# Altium project ESC_STM32.PrjPcb
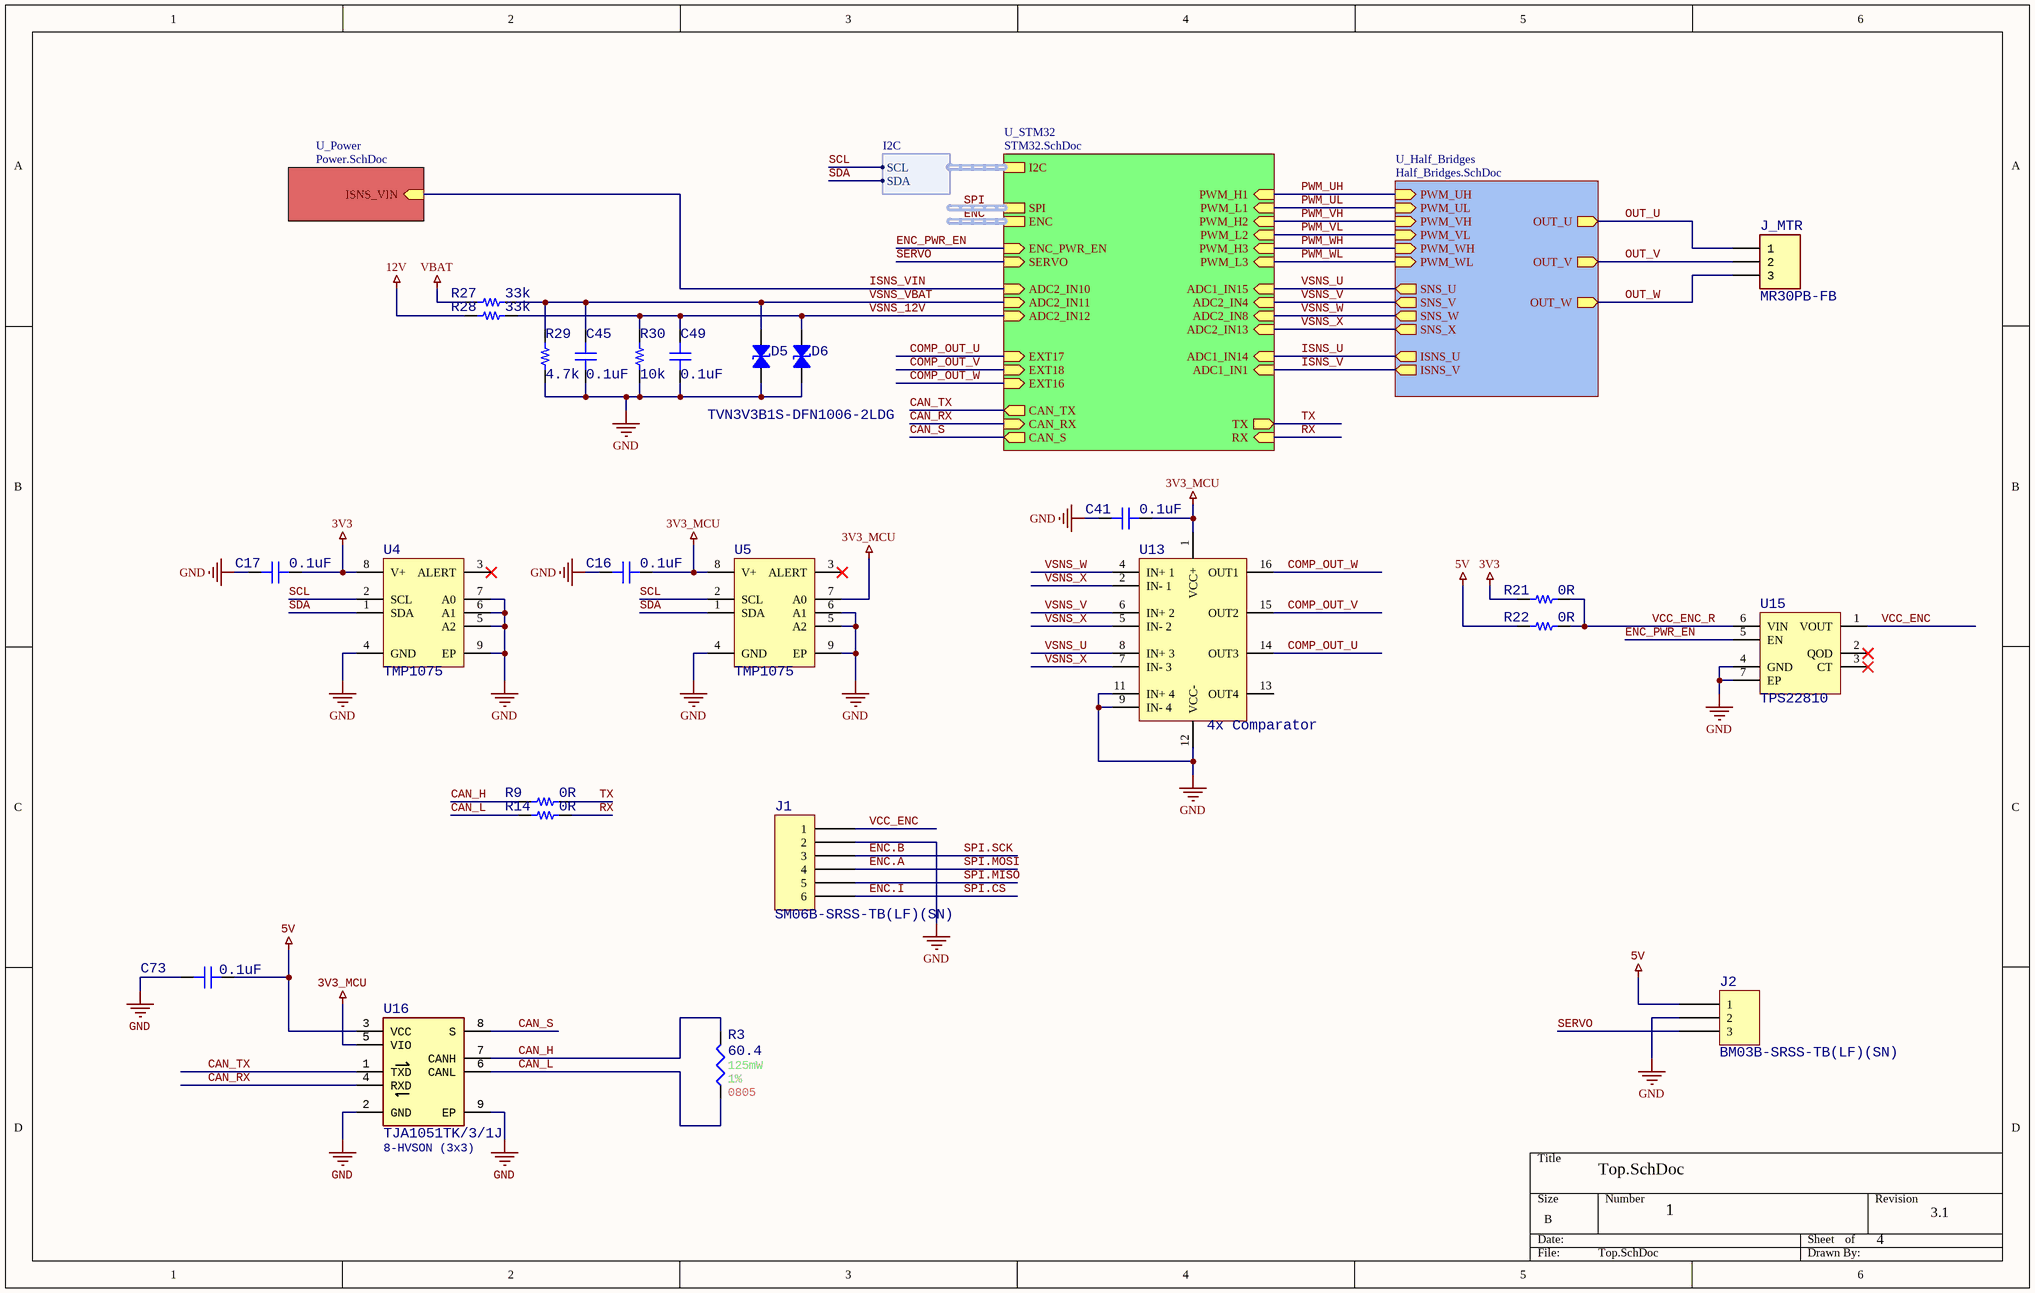
[diagram p0: Top.SchDoc]
Project: Cubli; ProjectRevision: 3.1
4 sheets, 153 parts. Net scope: hierarchical (ports join the sheet entries above them; power ports are global).
Board file: ESC_STM32.PcbDoc
Sheets:
  Top.SchDoc
    U_STM32 = STM32.SchDoc
    U_Power = Power.SchDoc
    U_Half_Bridges = Half_Bridges.SchDoc

## Sheet Top.SchDoc
size B; DocumentNumber: 5; Revision: 1.1; SheetNumber: 1; SheetTotal: 4

### Parts
C16  0.1uF  [CAP_0402]
C17  0.1uF  [CAP_0402]
C41  0.1uF  [CAP_0402]
C45  0.1uF  [CAP_0402]
C49  0.1uF  [CAP_0402]
C73  0.1uF  [CAP_0402]
D5  TVN3V3B1S-DFN1006-2LDG  [0402]
D6  TVN3V3B1S-DFN1006-2LDG  [0402]  (value not drawn)
J1  SM06B-SRSS-TB(LF)(SN)  [JST SM06B-SRSS-TB]
J2  BM03B-SRSS-TB(LF)(SN)  [JST BM03B-SRSS-TB]
J_MTR  MR30PB-FB  [MR30PB-F]
R3  value 60.4  Power: 125mW  Tolerance: 1%  Case/Package: 0805  [0805 Resistor]  (hidden comment: TFA0805R60R4F-T5)
R9  0R  [RES_0402]
R14  0R  [RES_0402]
R21  0R  [RES_0402]
R22  0R  [RES_0402]
R27  33k  [RES_0402]
R28  33k  [RES_0402]
R29  4.7k  [RES_0402]
R30  10k  [RES_0402]
U4  TMP1075  [8_WSON_2x2_0.5mm]
U5  TMP1075  [8_WSON_2x2_0.5mm]
U13  4x Comparator  [QFN50P300X300X100-16N]
U15  TPS22810  [6-WSON_2x2_0.65mm]
U16  TJA1051TK/3/1J  Case/Package: 8-HVSON (3x3)  [TJA1044xxK]

### Sub-sheets
U_Half_Bridges = Half_Bridges.SchDoc: PWM_UH (in), PWM_UL (in), PWM_VH (in), PWM_VL (in), PWM_WH (in), PWM_WL (in), SNS_U (out), SNS_V (out), SNS_W (out), SNS_X (out), OUT_U (out), OUT_V (out), OUT_W (out), ISNS_U (out), ISNS_V (out)
U_Power = Power.SchDoc: ISNS_VIN (in)
U_STM32 = STM32.SchDoc: I2C (harness I2C), PWM_L1 (in), PWM_H1 (in), PWM_L2 (in), PWM_H2 (in), PWM_L3 (in), PWM_H3 (in), ENC (harness ENC), ADC1_IN1 (in), ADC1_IN14 (in), EXT16 (in), EXT17 (in), EXT18 (in), ADC2_IN10 (in), SPI (harness SPI), ENC_PWR_EN (in), ADC2_IN11 (in), ADC2_IN12 (in), ADC2_IN4 (in), ADC2_IN8 (in), ADC2_IN13 (in), ADC1_IN15 (in), SERVO (in), CAN_TX (out), CAN_RX (in), CAN_S (out), TX (out), RX (in)

### Harnesses
I2C: SCL, SDA

### Nets
3V3: C17.2 R21.2 U4.8(V+)
3V3_MCU: C16.2 C41.2 U5.7(A0) U5.8(V+) U13.1(VCC+) U16.5(VIO)
5V: C73.1 J2.1 R22.2 U16.3(VCC)
12V: R28.2
GND: C16.1 C17.1 C41.1 C45.1 C49.1 C73.2 D5.1 D6.1 J1.2 J2.2 R29.2 R30.2 U4.4(GND) U4.5(A2) U4.6(A1) U4.7(A0) U4.9(EP) U5.4(GND) U5.5(A2) U5.6(A1) U5.9(EP) U13.9(IN-_4) U13.11(IN+_4) U13.12(VCC-) U15.4(GND) U15.7(EP) U16.2(GND) U16.9(EP)
VBAT: R27.2
CAN_H: R3.2 R9.2 U16.7(CANH)
CAN_L: R3.1 R14.2 U16.6(CANL)
CAN_RX: U16.4(RXD) ; sheet U_STM32/CAN_RX
CAN_S: U16.8(S) ; sheet U_STM32/CAN_S
CAN_TX: U16.1(TXD) ; sheet U_STM32/CAN_TX
COMP_OUT_U: U13.14(OUT3) ; sheet U_STM32/EXT17
COMP_OUT_V: U13.15(OUT2) ; sheet U_STM32/EXT18
COMP_OUT_W: U13.16(OUT1) ; sheet U_STM32/EXT16
ENC.A: J1.4  [also labelled SPI.MOSI]
ENC.B: J1.3  [also labelled SPI.SCK]
ENC.I: J1.6  [also labelled SPI.~{CS}]
ENC_PWR_EN: U15.5(EN) ; sheet U_STM32/ENC_PWR_EN
ISNS_U: sheet U_STM32/ADC1_IN14, sheet U_Half_Bridges/ISNS_U
ISNS_V: sheet U_STM32/ADC1_IN1, sheet U_Half_Bridges/ISNS_V
ISNS_VIN: sheet U_STM32/ADC2_IN10, sheet U_Power/ISNS_VIN
OUT_U: J_MTR.1 ; sheet U_Half_Bridges/OUT_U
OUT_V: J_MTR.2 ; sheet U_Half_Bridges/OUT_V
OUT_W: J_MTR.3 ; sheet U_Half_Bridges/OUT_W
PWM_UH: sheet U_STM32/PWM_H1, sheet U_Half_Bridges/PWM_UH
PWM_UL: sheet U_STM32/PWM_L1, sheet U_Half_Bridges/PWM_UL
PWM_VH: sheet U_STM32/PWM_H2, sheet U_Half_Bridges/PWM_VH
PWM_VL: sheet U_STM32/PWM_L2, sheet U_Half_Bridges/PWM_VL
PWM_WH: sheet U_STM32/PWM_H3, sheet U_Half_Bridges/PWM_WH
PWM_WL: sheet U_STM32/PWM_L3, sheet U_Half_Bridges/PWM_WL
RX: R14.1 ; sheet U_STM32/RX
SCL: U4.2(SCL) U5.2(SCL) ; sheet U_STM32/I2C.SCL
SDA: U4.1(SDA) U5.1(SDA) ; sheet U_STM32/I2C.SDA
SERVO: J2.3 ; sheet U_STM32/SERVO
SPI.MISO: J1.5
TX: R9.1 ; sheet U_STM32/TX
VCC_ENC: J1.1 U15.1(VOUT)
VCC_ENC_R: R21.1 R22.1 U15.6(VIN)
VSNS_12V: C49.2 D6.2 R28.1 R30.1 ; sheet U_STM32/ADC2_IN12
VSNS_U: U13.8(IN+_3) ; sheet U_STM32/ADC1_IN15, sheet U_Half_Bridges/SNS_U
VSNS_V: U13.6(IN+_2) ; sheet U_STM32/ADC2_IN4, sheet U_Half_Bridges/SNS_V
VSNS_VBAT: C45.2 D5.2 R27.1 R29.1 ; sheet U_STM32/ADC2_IN11
VSNS_W: U13.4(IN+_1) ; sheet U_STM32/ADC2_IN8, sheet U_Half_Bridges/SNS_W
VSNS_X: U13.2(IN-_1) U13.5(IN-_2) U13.7(IN-_3) ; sheet U_STM32/ADC2_IN13, sheet U_Half_Bridges/SNS_X

Not connected (* = marked no-connect by the designer): U4 3(ALERT)*; U5 3(ALERT)*; U13 13(OUT4); U15 2(QOD)* 3(CT)*

### Buses and harness runs
harness ENC = sheet U_STM32/ENC
harness SPI = sheet U_STM32/SPI

### Library data of the parts
C16 C17 C41 C45 C49 C73 = CAP_0402: CAP CER 402; Value: 0.1uF
D5 D6 = TVN3V3B1S-DFN1006-2LDG: TVS DIODE 3.3V 14.2PF DFN1006; Manufacturer: INPAQ Technology Co., Ltd; Bidirectional Channels: 1; Capacitance @ Frequency: 11.5pF @ 1MHz; Current - Peak Pulse (10/1000µs): 8A (8/20µs); Power Line Protection: No; Type: Zener; Voltage - Breakdown (Min): 4V; Voltage - Clamping (Max) @ Ipp: 6.6V (Typ); Voltage - Reverse Standoff (Typ): 3.3V (Max); Part Number: TVN3V3B1S-DFN1006-2LDG; Applications: General Purpose; ComponentLink1Description: Datasheet; ComponentLink1URL: https://mm.digikey.com/Volume0/opasdata/d220001/medias/docus/5383/TVN3V3B1S-DFN1006-2LDG.pdf; ComponentLink2Description: DigiKey Link; ComponentLink2URL: https://www.digikey.com/en/products/detail/inpaq-technology-co-ltd/TVN3V3B1S-DFN1006-2LDG/20486686; Device Package: 0402 (1005 Metric); LastUpdated: 6/3/2024 8:22:57 PM; Lifecycle Status: Active; Minimum Order: 1; Mounting Type: Surface Mount; Operating Temperature: 150°C (TJ); Package / Case: 0402 (1005 Metric); Packaging: TapeAndReel; PartId: 11821; Price: 0.02; Series: TVN; Supplier 1: DigiKey; Supplier Part Number 1: 3526-TVN3V3B1S-DFN1006-2LDGCT-ND; Supplier Device Package: DFN1006
J1 = SM06B-SRSS-TB(LF)(SN): CONN HEADER SMD R/A 6POS 1MM; Manufacturer: JST Sales America Inc.; Current Rating (Amps): 0.7A; Material Flammability Rating: UL94 V-0; Number of Positions: 6; Number of Positions Loaded: All; Pitch - Mating: 0.039" (1.00mm); Shrouding: Shrouded - 4 Wall; Style: Board to Cable/Wire; Voltage Rating: 50V; Part Number: SM06B-SRSS-TB(LF)(SN); ComponentLink1Description: Datasheet; ComponentLink1URL: http://www.jst-mfg.com/product/pdf/eng/eSH.pdf; ComponentLink2Description: DigiKey Link; ComponentLink2URL: http://digikey.com/product-detail/en/jst-sales-america-inc/SM06B-SRSS-TB-LF-SN/455-1806-1-ND/926877; Connector Type: Header; Contact Finish - Mating: Tin; Contact Finish - Post: Tin; Contact Material: Copper Alloy; Contact Shape: Square; Contact Type: Male Pin; Fastening Type: Push-Pull; Features: Solder Retention; Insulation Color: Natural; Insulation Height: 0.114" (2.90mm); Insulation Material: Polyamide (PA), Nylon; LastUpdated: 1/12/2020 11:42:14 PM; Lifecycle Status: Active; Minimum Order: 1; Mounting Type: Surface Mount, Right Angle; Number of Rows: 1; Operating Temperature: -25°C ~ 85°C; Packaging: TapeAndReel; PartId: 64; Part Status: Active; Price: 0.36; Series: SR; Supplier 1: DigiKey; Supplier Part Number 1: 455-1806-1-ND; Termination: Solder
J2 = BM03B-SRSS-TB(LF)(SN): CONN HEADER SMD 3POS 1MM; Manufacturer: JST Sales America Inc.; Current Rating (Amps): 0.7A; Material Flammability Rating: UL94 V-0; Number of Positions: 3; Number of Positions Loaded: All; Pitch - Mating: 0.039" (1.00mm); Shrouding: Shrouded - 4 Wall; Style: Board to Cable/Wire; Voltage Rating: 50V; Part Number: BM03B-SRSS-TB(LF)(SN); ComponentLink1Description: Datasheet; ComponentLink1URL: http://www.jst-mfg.com/product/pdf/eng/eSR.pdf; ComponentLink2Description: DigiKey Link; ComponentLink2URL: http://digikey.com/product-detail/en/jst-sales-america-inc/BM03B-SRSS-TB-LF-SN/455-1789-1-ND/926860; Connector Type: Header; Contact Finish - Mating: Tin; Contact Finish - Post: Tin; Contact Material: Copper Alloy; Contact Shape: Square; Contact Type: Male Pin; Fastening Type: Push-Pull; Features: Solder Retention; Insulation Color: Natural; Insulation Height: 0.167" (4.25mm); Insulation Material: Polyamide (PA), Nylon; LastUpdated: 1/12/2020 10:12:14 PM; Lifecycle Status: Active; Minimum Order: 1; Mounting Type: Surface Mount; Number of Rows: 1; Operating Temperature: -25°C ~ 85°C; Packaging: TapeAndReel; PartId: 14; Part Status: Active; Price: 0.24; Series: SR; Supplier 1: DigiKey; Supplier Part Number 1: 455-1789-1-ND; Termination: Solder
J_MTR = CMP-002-00125-1: Vertical 3 pin barrel connector; Manufacturer: Amass; Gender: Female; Max Current Rating: 30A; Pins: 3
R3 = CMP-009-00189-2: Res 60.4 Ohm 1% 1/8W 0805; AECQ: Yes; Manufacturer Part Number: TFA0805R60R4F-T5; Mounting Technology: SMD; Pins: 2
R9 R14 R21 R22 R27-R30 = RES_0402: RES 0402
U4 U5 = TMP1075: I2C TEMP SENSOR
U13 = LM2901Q4T: Comparator General Purpose CMOS, DTL, MOS, Open-Collector, TTL 16-QFN (3x3)
U15 = TPS22810DRVR: Load switch TPS22810DRVR
U16 = CMP-031-00007-3: Interface Circuit, PDSO8; AECQ: Yes; Max Operating Temperature: 150°C; Pins: 8; Min Operating Temperature: -40°C

## Sheet STM32.SchDoc
size B; DocumentNumber: 3; SheetNumber: 2; SheetTotal: 4
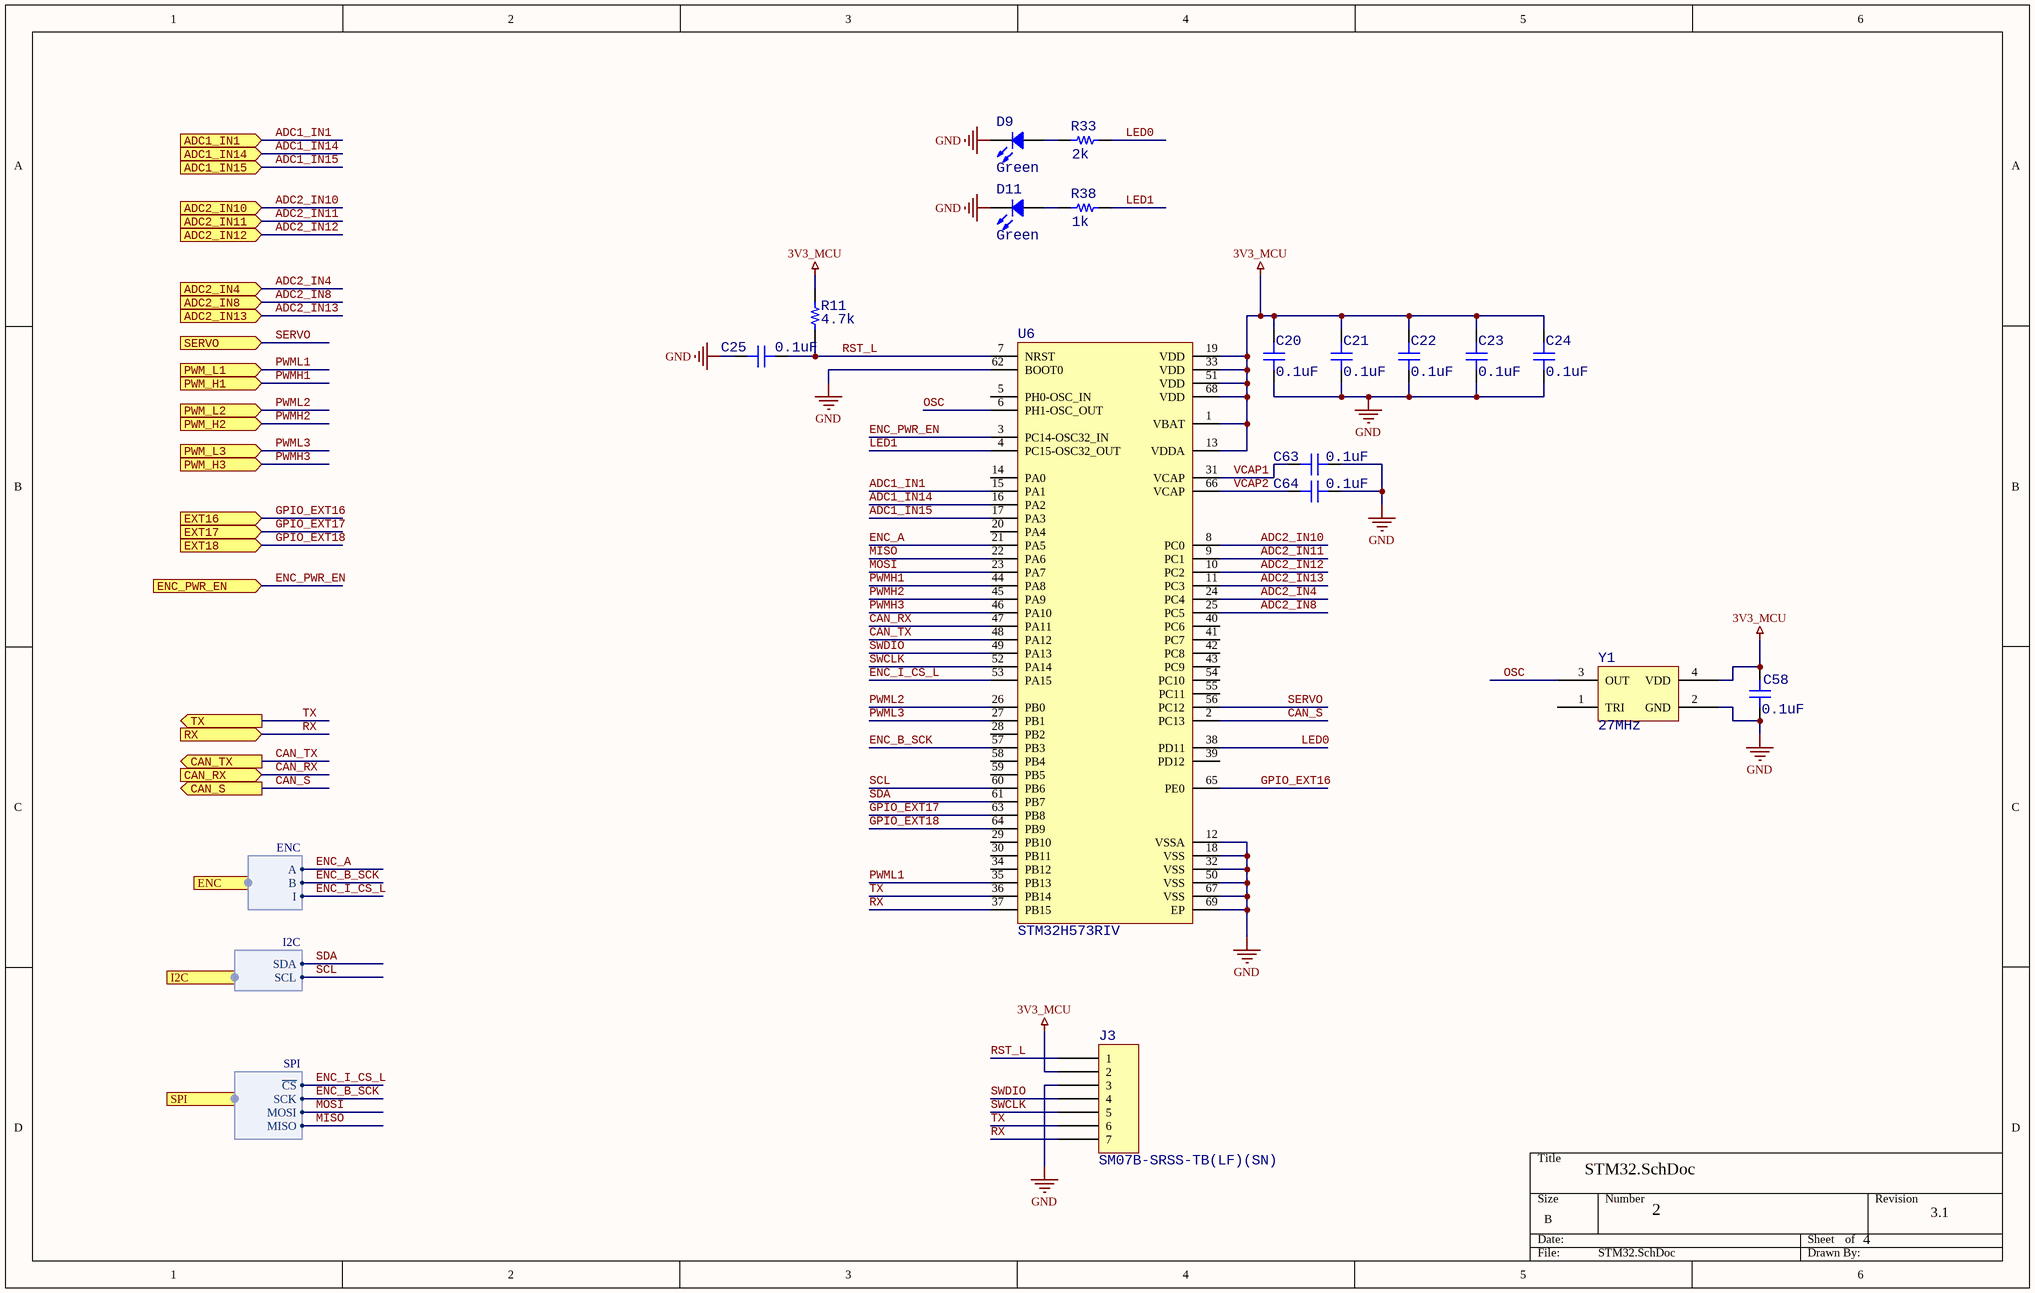
[diagram p1: STM32.SchDoc]

### Parts
C20  0.1uF  [CAP_0402]
C21  0.1uF  [CAP_0402]
C22  0.1uF  [CAP_0402]
C23  0.1uF  [CAP_0402]
C24  0.1uF  [CAP_0402]
C25  0.1uF  [CAP_0402]
C58  0.1uF  [CAP_0402]
C63  0.1uF  [CAP_0402]
C64  0.1uF  [CAP_0402]
D9  Green  [LED 0603_1608 GREEN]
D11  Green  [LED 0603_1608 GREEN]
J3  SM07B-SRSS-TB(LF)(SN)  [JST SM07B-SRSS-TB]
R11  4.7k  [RES_0402]
R33  2k  [RES_0402]
R38  1k  [RES_0402]
U6  STM32H573RIV  [68-VFQFPN]
Y1  27MHz  [ABRACON ASD]

### Ports
ADC1_IN1 (in), ADC1_IN14 (in), ADC1_IN15 (in), ADC2_IN4 (in), ADC2_IN8 (in), ADC2_IN10 (in), ADC2_IN11 (in), ADC2_IN12 (in), ADC2_IN13 (in), CAN_RX (in), CAN_S (out), CAN_TX (out), ENC (harness ENC), ENC_PWR_EN (in), EXT16 (in), EXT17 (in), EXT18 (in), I2C (harness I2C), PWM_H1 (in), PWM_H2 (in), PWM_H3 (in), PWM_L1 (in), PWM_L2 (in), PWM_L3 (in), RX (in), SERVO (in), SPI (harness SPI), TX (out)

### Harnesses
I2C: SDA, SCL
ENC: A, B, I
SPI: ~{CS}, SCK, MOSI, MISO

### Nets
3V3_MCU: C20.2 C21.2 C22.2 C23.2 C24.2 C58.2 J3.2 R11.2 U6.1(VBAT) U6.13(VDDA) U6.19(VDD) U6.33(VDD) U6.51(VDD) U6.68(VDD) Y1.4(VDD)
GND: C20.1 C21.1 C22.1 C23.1 C24.1 C25.2 C58.1 C63.1 C64.1 D9.2 D11.2 J3.3 U6.12(VSSA) U6.18(VSS) U6.32(VSS) U6.50(VSS) U6.62(BOOT0) U6.67(VSS) U6.69(EP) Y1.2(GND)
ADC1_IN1: U6.15(PA1) ; port ADC1_IN1  [project net ISNS_V]
ADC1_IN14: U6.16(PA2) ; port ADC1_IN14  [project net ISNS_U]
ADC1_IN15: U6.17(PA3) ; port ADC1_IN15  [project net VSNS_U]
ADC2_IN4: U6.24(PC4) ; port ADC2_IN4  [project net VSNS_V]
ADC2_IN8: U6.25(PC5) ; port ADC2_IN8  [project net VSNS_W]
ADC2_IN10: U6.8(PC0) ; port ADC2_IN10  [project net ISNS_VIN]
ADC2_IN11: U6.9(PC1) ; port ADC2_IN11  [project net VSNS_VBAT]
ADC2_IN12: U6.10(PC2) ; port ADC2_IN12  [project net VSNS_12V]
ADC2_IN13: U6.11(PC3) ; port ADC2_IN13  [project net VSNS_X]
CAN_RX: U6.47(PA11) ; port CAN_RX
CAN_S: U6.2(PC13) ; port CAN_S
CAN_TX: U6.48(PA12) ; port CAN_TX
ENC_A: U6.21(PA5) ; port ENC.A  [project net ENC.A]
ENC_B_SCK: U6.57(PB3) ; port ENC.B, port SPI.SCK  [project net ENC.B]
ENC_I_CS_L: U6.53(PA15) ; port ENC.I, port SPI.~{CS}  [project net ENC.I]
ENC_PWR_EN: U6.3(PC14-OSC32_IN) ; port ENC_PWR_EN
GPIO_EXT16: U6.65(PE0) ; port EXT16  [project net COMP_OUT_W]
GPIO_EXT17: U6.63(PB8) ; port EXT17  [project net COMP_OUT_U]
GPIO_EXT18: U6.64(PB9) ; port EXT18  [project net COMP_OUT_V]
LED0: R33.2 U6.38(PD11)
LED1: R38.2 U6.4(PC15-OSC32_OUT)
MISO: U6.22(PA6) ; port SPI.MISO  [project net SPI.MISO]
MOSI: U6.23(PA7) ; port SPI.MOSI  [project net SPI.MOSI]
OSC: U6.6(PH1-OSC_OUT) Y1.3(OUT)
PWMH1: U6.44(PA8) ; port PWM_H1  [project net PWM_UH]
PWMH2: U6.45(PA9) ; port PWM_H2  [project net PWM_VH]
PWMH3: U6.46(PA10) ; port PWM_H3  [project net PWM_WH]
PWML1: U6.35(PB13) ; port PWM_L1  [project net PWM_UL]
PWML2: U6.26(PB0) ; port PWM_L2  [project net PWM_VL]
PWML3: U6.27(PB1) ; port PWM_L3  [project net PWM_WL]
RST_L: C25.1 J3.1 R11.1 U6.7(NRST)
RX: J3.7 U6.37(PB15) ; port RX
SCL: U6.60(PB6) ; port I2C.SCL
SDA: U6.61(PB7) ; port I2C.SDA
SERVO: U6.56(PC12) ; port SERVO
SWCLK: J3.5 U6.52(PA14)
SWDIO: J3.4 U6.49(PA13)
TX: J3.6 U6.36(PB14) ; port TX
VCAP1: C63.2 U6.31(VCAP)
VCAP2: C64.2 U6.66(VCAP)
NetD9_1: D9.1 R33.1
NetD11_1: D11.1 R38.1

Not connected (* = marked no-connect by the designer): U6 5(PH0-OSC_IN) 14(PA0) 20(PA4) 28(PB2) 29(PB10) 30(PB11) 34(PB12) 39(PD12) 40(PC6) 41(PC7) 42(PC8) 43(PC9) 54(PC10) 55(PC11) 58(PB4) 59(PB5); Y1 1(TRI)

### Library data of the parts
C20-C25 C58 C63 C64 = CAP_0402: CAP CER 402; Value: 0.1uF
D9 D11 = XZCDGK53W-8VF: LED GREEN CLEAR 2SMD; Manufacturer: SunLED; Configuration: Independent; Current - Test: 2mA; Lens Color: Colorless; Lens Size: 0.35mm Dia; Lens Style: Round with Domed Top; Millicandela Rating: 417mcd; Viewing Angle: 60°; Voltage - Forward (Vf) (Typ): 2.65V; Wavelength - Dominant: 525nm; Wavelength - Peak: 515nm; Part Number: XZCDGK53W-8VF; Color: Green; ComponentLink1Description: Datasheet; ComponentLink1URL: https://www.sunledusa.com/products/spec/XZCDGK53W-8VF.pdf; ComponentLink2Description: DigiKey Link; ComponentLink2URL: https://www.digikey.com/en/products/detail/sunled/XZCDGK53W-8VF/10449775; Device Package: 0603 (1608 Metric); Height (Max): 1.10mm; LastUpdated: 6/3/2024 7:58:52 PM; Lens Transparency: Clear; Lifecycle Status: Active; Minimum Order: 1; Mounting Type: Surface Mount; Package / Case: 0603 (1608 Metric); Packaging: TapeAndReel; PartId: 938; Part Status: Active; Price: 0.15; Series: Ultra Low Current; Size / Dimension: 1.60mm L x 0.80mm W; Supplier 1: DigiKey; Supplier Part Number 1: 1497-XZCDGK53W-8VFCT-ND; Supplier Device Package: 2-SMD; Value: Green
J3 = SM07B-SRSS-TB(LF)(SN): CONN HEADER SMD R/A 7POS 1MM; Manufacturer: JST Sales America Inc.; Current Rating (Amps): 0.7A; Material Flammability Rating: UL94 V-0; Number of Positions: 7; Number of Positions Loaded: All; Pitch - Mating: 0.039" (1.00mm); Shrouding: Shrouded - 4 Wall; Style: Board to Cable/Wire; Voltage Rating: 50V; Part Number: SM07B-SRSS-TB(LF)(SN); ComponentLink1Description: Datasheet; ComponentLink1URL: http://www.jst-mfg.com/product/pdf/eng/eSH.pdf; ComponentLink2Description: DigiKey Link; ComponentLink2URL: http://digikey.com/product-detail/en/jst-sales-america-inc/SM07B-SRSS-TB-LF-SN/455-1807-1-ND/926878; Connector Type: Header; Contact Finish - Mating: Tin; Contact Finish - Post: Tin; Contact Material: Copper Alloy; Contact Shape: Square; Contact Type: Male Pin; Fastening Type: Push-Pull; Features: Solder Retention; Insulation Color: Natural; Insulation Height: 0.114" (2.90mm); Insulation Material: Polyamide (PA), Nylon; LastUpdated: 1/12/2020 11:42:26 PM; Lifecycle Status: Active; Minimum Order: 1; Mounting Type: Surface Mount, Right Angle; Number of Rows: 1; Operating Temperature: -25°C ~ 85°C; Packaging: TapeAndReel; PartId: 65; Part Status: Active; Price: 0.39; Series: SR; Supplier 1: DigiKey; Supplier Part Number 1: 455-1807-1-ND; Termination: Solder
R11 R33 R38 = RES_0402: RES 0402
Y1 = ASD3-27.000MHZ-EC-T: XTAL OSC XO 27.0000MHZ HCMOS SMD; Manufacturer: Abracon LLC; Base Resonator: Crystal; Current - Supply (Max): 4mA; Frequency Stability: ±50ppm; Function: Enable/Disable; Voltage - Supply: 1.8V; Part Number: ASD3-27.000MHZ-EC-T; ComponentLink1Description: Datasheet; ComponentLink1URL: https://abracon.com/Oscillators/ASDseries.pdf; ComponentLink2Description: DigiKey Link; ComponentLink2URL: http://digikey.com/product-detail/en/abracon-llc/ASD3-27.000MHZ-EC-T/535-9608-1-ND/1237075; Frequency: 27MHz; Height - Seated (Max): 0.039" (1.00mm); LastUpdated: 6/3/2024 8:02:05 PM; Lifecycle Status: Active; Minimum Order: 1; Mounting Type: Surface Mount; Operating Temperature: -20°C ~ 70°C; Output: HCMOS; Package / Case: 4-SMD, No Lead; Packaging: TapeAndReel; PartId: 4; Part Status: Active; Price: 1.74; Series: ASD; Size / Dimension: 0.098" L x 0.079" W (2.50mm x 2.00mm); Supplier 1: DigiKey; Supplier Part Number 1: 535-9608-1-ND; Type: XO (Standard); Value: 27MHz

## Sheet Power.SchDoc
size B; DocumentNumber: 4; SheetNumber: 3; SheetTotal: 4
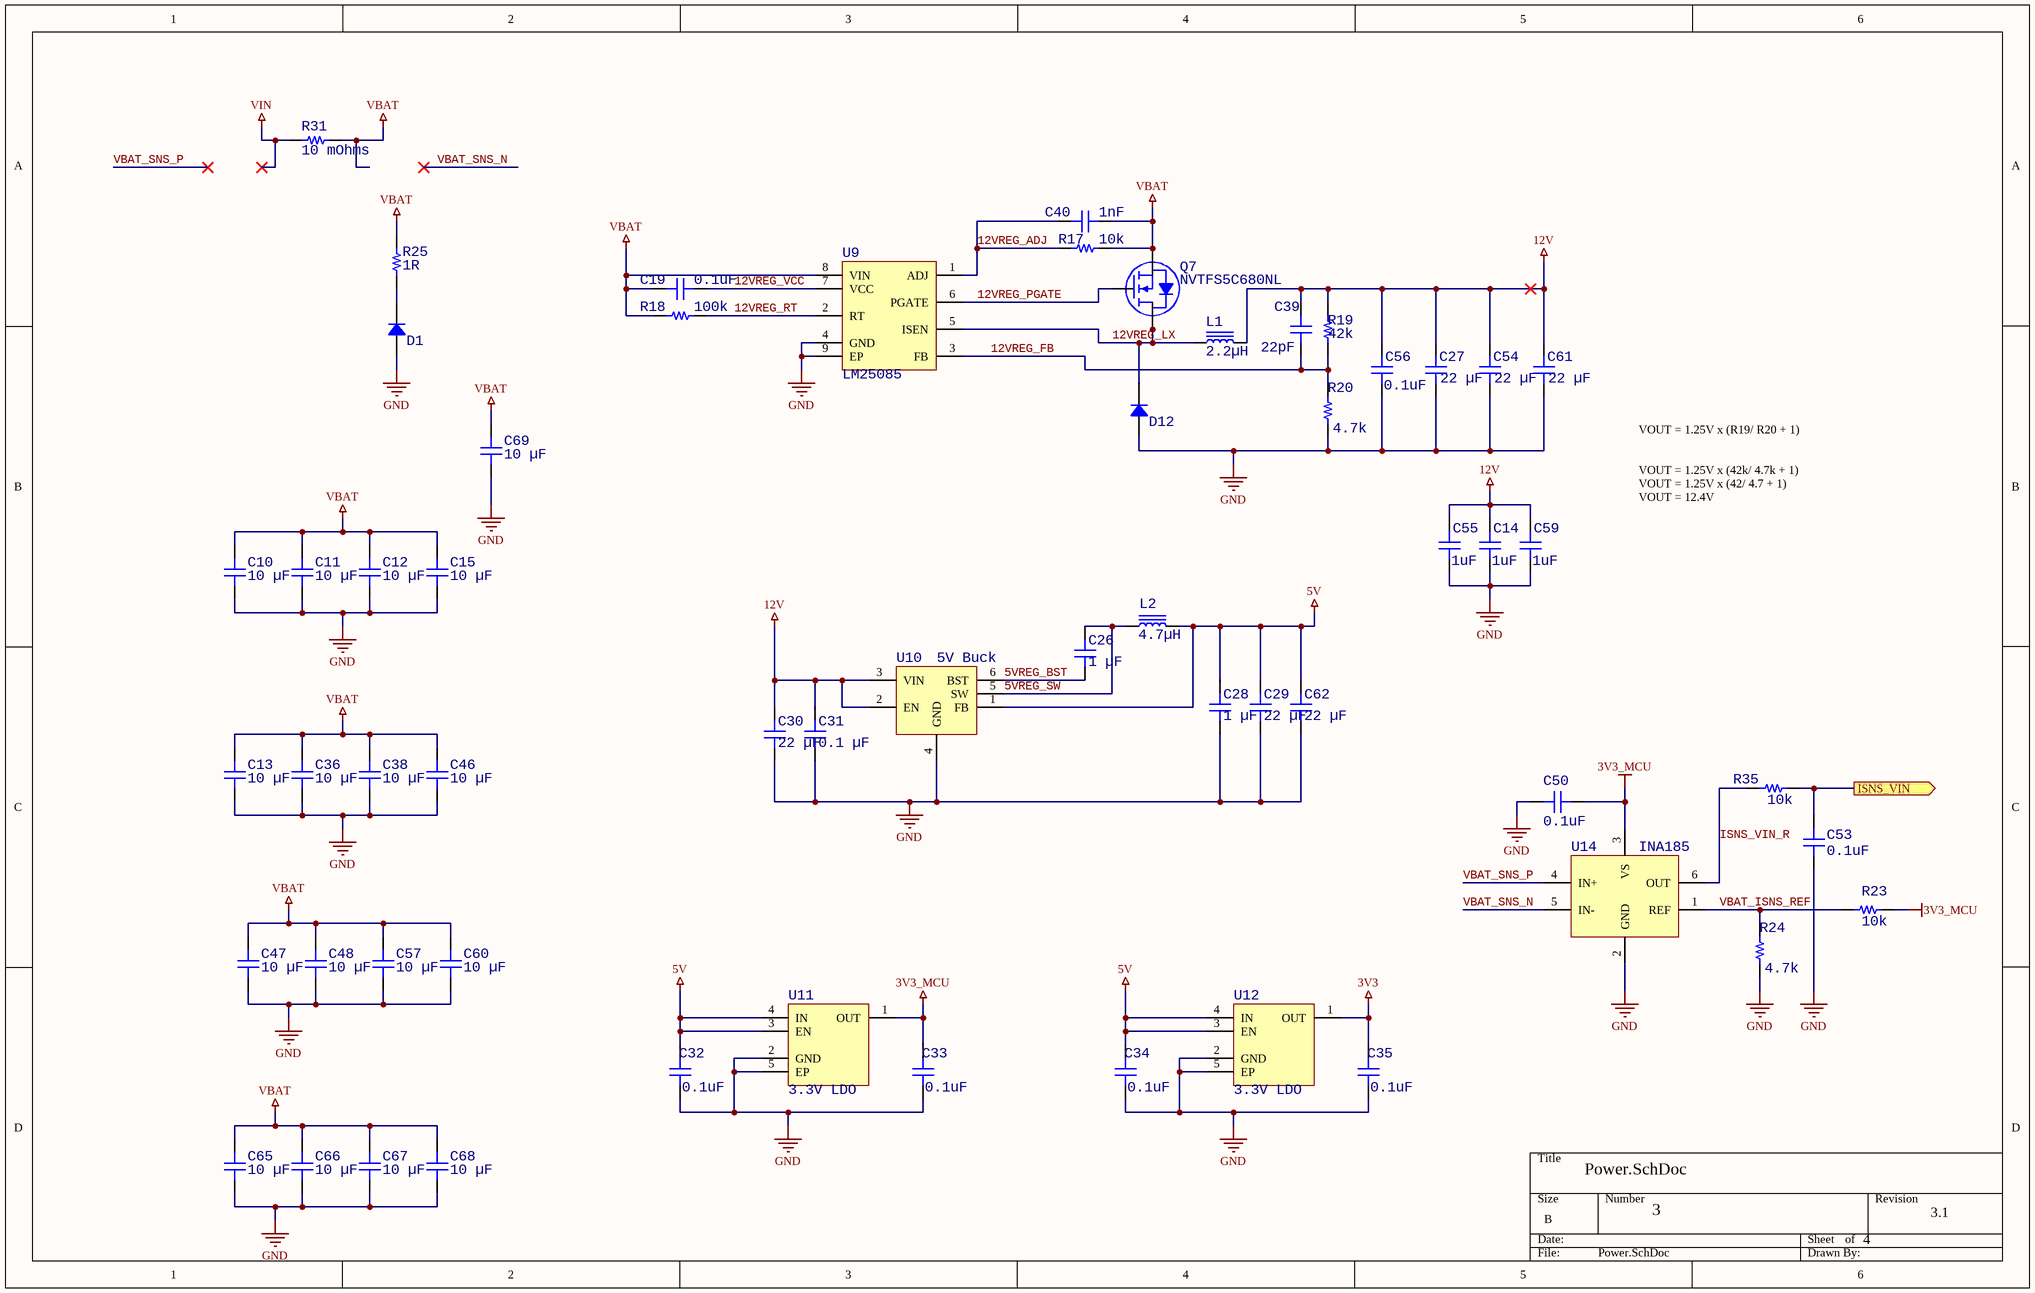
[diagram p2: Power.SchDoc]

### Parts
C10  10 µF  [CAP 1206_3216 - 0.8MM]
C11  10 µF  [CAP 1206_3216 - 0.8MM]
C12  10 µF  [CAP 1206_3216 - 0.8MM]
C13  10 µF  [CAP 1206_3216 - 0.8MM]
C14  1uF  [CAP_0402]
C15  10 µF  [CAP 1206_3216 - 0.8MM]
C19  0.1uF  [CAP_0402]
C26  1 µF  [CAP 0402_1005]
C27  22 µF  [CAP 0805_2012]
C28  1 µF  [CAP 0402_1005]
C29  22 µF  [CAP 0603_1608]
C30  22 µF  [CAP 0603_1608]
C31  0.1 µF  [CAP 0402_1005]
C32  0.1uF  [CAP_0402]
C33  0.1uF  [CAP_0402]
C34  0.1uF  [CAP_0402]
C35  0.1uF  [CAP_0402]
C36  10 µF  [CAP 1206_3216 - 0.8MM]
C38  10 µF  [CAP 1206_3216 - 0.8MM]
C39  22pF  [CAP_0402]
C40  1nF  [CAP_0402]
C46  10 µF  [CAP 1206_3216 - 0.8MM]
C47  10 µF  [CAP 1206_3216 - 0.8MM]
C48  10 µF  [CAP 1206_3216 - 0.8MM]
C50  0.1uF  [CAP_0402]
C53  0.1uF  [CAP_0402]
C54  22 µF  [CAP 0805_2012]
C55  1uF  [CAP_0402]
C56  0.1uF  [CAP_0402]
C57  10 µF  [CAP 1206_3216 - 0.8MM]
C59  1uF  [CAP_0402]
C60  10 µF  [CAP 1206_3216 - 0.8MM]
C61  22 µF  [CAP 0805_2012]
C62  22 µF  [CAP 0603_1608]
C65  10 µF  [CAP 1206_3216 - 0.8MM]
C66  10 µF  [CAP 1206_3216 - 0.8MM]
C67  10 µF  [CAP 1206_3216 - 0.8MM]
C68  10 µF  [CAP 1206_3216 - 0.8MM]
C69  10 µF  [CAP 1206_3216 - 0.8MM]
D1  SE10FGHM3/H  [SMF DO-219AB]  (value not drawn)
D12  SE10FGHM3/H  [SMF DO-219AB]  (value not drawn)
L1  2.2µH  [IND 1008_2520]
L2  4.7µH  [IND 1008_2520]
Q7  NVTFS5C680NL  [NVTFS015N04CTAG]
R17  10k  [RES_0402]
R18  100k  [RES_0402]
R19  42k  [RES_0402]
R20  4.7k  [RES_0402]
R23  10k  [RES_0402]
R24  4.7k  [RES_0402]
R25  1R  [RES 0603_1608]
R31  10 mOhms  [RES 1206_3216]
R35  10k  [RES_0402]
U9  LM25085  [8_WSON_3x3_0.5mm]
U10  5V Buck  [TSOT-26-6 - 3.2mm]
U11  3.3V LDO  [XDFN-4]
U12  3.3V LDO  [XDFN-4]
U14  INA185  [TI SC70-6 DCK]

### Ports
ISNS_VIN (out)

### Nets
3V3: C35.2 U12.1(OUT)
3V3_MCU: C33.2 C50.1 R23.1 U11.1(OUT) U14.3(VS)
5V: C28.2 C29.2 C32.2 C34.2 C62.2 L2.2 U10.1(FB) U11.3(EN) U11.4(IN) U12.3(EN) U12.4(IN)
12V: C14.2 C27.2 C30.2 C31.2 C39.2 C54.2 C55.2 C56.2 C59.2 C61.2 L1.2 R19.1 U10.2(EN) U10.3(VIN)
GND: C10.1 C11.1 C12.1 C13.1 C14.1 C15.1 C27.1 C28.1 C29.1 C30.1 C31.1 C32.1 C33.1 C34.1 C35.1 C36.1 C38.1 C46.1 C47.1 C48.1 C50.2 C53.2 C54.1 C55.1 C56.1 C57.1 C59.1 C60.1 C61.1 C62.1 C65.1 C66.1 C67.1 C68.1 C69.1 D1.1 D12.1 R20.2 R24.2 U9.4(GND) U9.9(EP) U10.4(GND) U11.2(GND) U11.5(EP) U12.2(GND) U12.5(EP) U14.2(GND)
VBAT: C10.2 C11.2 C12.2 C13.2 C15.2 C19.1 C36.2 C38.2 C40.2 C46.2 C47.2 C48.2 C57.2 C60.2 C65.2 C66.2 C67.2 C68.2 C69.2 Q7.1(S) Q7.2(S) Q7.3(S) R17.1 R18.2 R25.2 R31.2 U9.8(VIN)
VIN: R31.1
5VREG_BST: C26.1 U10.6(BST)
5VREG_SW: C26.2 L2.1 U10.5(SW)
12VREG_ADJ: C40.1 R17.2 U9.1(ADJ)
12VREG_FB: C39.1 R19.2 R20.1 U9.3(FB)
12VREG_LX: D12.2 L1.1 Q7.5(D) Q7.6(D) Q7.7(D) Q7.8(D) U9.5(ISEN)
12VREG_PGATE: Q7.4(G) U9.6(PGATE)
12VREG_RT: R18.1 U9.2(RT)
12VREG_VCC: C19.2 U9.7(VCC)
ISNS_VIN: C53.1 R35.1 ; port ISNS_VIN
ISNS_VIN_R: R35.2 U14.6(OUT)
VBAT_ISNS_REF: R23.2 R24.1 U14.1(REF)
VBAT_SNS_N: U14.5(IN-)
VBAT_SNS_P: U14.4(IN+)
NetD1_2: D1.2 R25.1

### Notes on the sheet
- VOUT = 1.25V x (R19/ R20 + 1)
- VOUT = 1.25V x (42k/ 4.7k + 1)
  VOUT = 1.25V x (42/ 4.7 + 1)
  VOUT = 12.4V

### Library data of the parts
C10-C13 C15 C36 C38 C46-C48 C57 C60 C65-C69 = CL31X106KAHNNNE: CAP CER 10UF 25V X6S 1206; manufacturer: Samsung Electro-Mechanics; Tolerance: ±10%; Part Number: CL31X106KAHNNNE; Value: 10 µF; Applications: General Purpose; Capacitance: 10 µF; componentlink1description: Datasheet; componentlink1url: http://www.samsungsem.com/kr/support/product-search/mlcc/CL31X106KAHNNNE.jsp; componentlink2description: DigiKey Link; componentlink2url: https://www.digikey.com/en/products/detail/samsung-electro-mechanics/CL31X106KAHNNNE/3888956; Device Package: 1206 (3216 Metric); lastupdated: 6/4/2024 7:10:40 PM; Lifecycle Status: Active; Minimum Order: 1; Mounting Type: Surface Mount, MLCC; Operating Temperature: -55°C ~ 105°C; Package / Case: 1206 (3216 Metric); packaging: TapeAndReel; partid: 20108; Part Status: Active; price: 0.05; series: CL; Size / Dimension: 0.126" L x 0.063" W (3.20mm x 1.60mm); Supplier 1: DigiKey; Supplier Part Number 1: 1276-3298-1-ND; Temperature Coefficient: X6S; Thickness (Max): 0.071" (1.80mm); Voltage - Rated: 25V
C14 C19 C32-C35 C39 C40 C50 C53 C55 C56 C59 = CAP_0402: CAP CER 402
  C14 C55 C59: Value: 1uF
  C19 C32-C35 C50 C53 C56: Value: 0.1uF
  C39: Value: 22pF
  C40: Value: 1nF
C26 C28 = C0402C104K4RACAUTO: CAP CER 0.1UF 16V X7R 0402; manufacturer: KEMET; Capacitance: 0.1 µF; Tolerance: ±10%; Part Number: C0402C104K4RACAUTO; Value: 1 µF; Applications: Automotive, Bypass, Decoupling; componentlink1description: Datasheet; componentlink1url: https://api.kemet.com/component-edge/download/specsheet/C0402C104K4RACAUTO.pdf; componentlink2description: DigiKey Link; componentlink2url: https://www.digikey.com/en/products/detail/kemet/C0402C104K4RACAUTO/3314827; Device Package: 0402 (1005 Metric); lastupdated: 2/9/2024 8:04:35 PM; Lifecycle Status: Active; Minimum Order: 1; Mounting Type: Surface Mount, MLCC; Operating Temperature: -55°C ~ 125°C; Package / Case: 0402 (1005 Metric); packaging: TapeAndReel; partid: 3024; Part Status: Active; price: 0.01; Ratings: AEC-Q200; series: SMD Auto X7R; Size / Dimension: 0.039" L x 0.020" W (1.00mm x 0.50mm); Supplier 1: DigiKey; Supplier Part Number 1: 399-6828-1-ND; Temperature Coefficient: X7R; Thickness (Max): 0.022" (0.55mm); Voltage - Rated: 16V
C27 C54 C61 = KGM21AS61C226MU: CAP CER 22UF 16V X6S 0805; manufacturer: KYOCERA AVX; Tolerance: ±20%; Part Number: KGM21AS61C226MU; Value: 22 µF; Applications: General Purpose; Capacitance: 22 µF; componentlink1description: Datasheet; componentlink1url: https://media.digikey.com/pdf/Data%20Sheets/AVX%20PDFs/CM03_CM05_CM105_CM21_CM316_Spec.pdf; componentlink2description: DigiKey Link; componentlink2url: https://www.digikey.com/en/products/detail/kyocera-avx/KGM21AS61C226MU/17827473; Device Package: 0805 (2012 Metric); lastupdated: 2/9/2024 8:14:12 PM; Lifecycle Status: Active; Minimum Order: 1; Mounting Type: Surface Mount, MLCC; Operating Temperature: -55°C ~ 105°C; Package / Case: 0805 (2012 Metric); packaging: TapeAndReel; partid: 52516; Part Status: Active; price: 0.12; series: KGM - X6S; Size / Dimension: 0.079" L x 0.049" W (2.01mm x 1.25mm); Supplier 1: DigiKey; Supplier Part Number 1: 478-KGM21AS61C226MUCT-ND; Temperature Coefficient: X6S; Thickness (Max): 0.057" (1.45mm); Voltage - Rated: 16V
C29 C30 C62 = C0603B476M007T: CAP CER 47UF 6.3V X5R 0603; manufacturer: Holy Stone Enterprise Co., Ltd.; Capacitance: 47 µF; Tolerance: ±20%; Part Number: C0603B476M007T; Value: 22 µF; Applications: SMPS Filtering; componentlink1description: Datasheet; componentlink1url: https://media.digikey.com/pdf/Data%20Sheets/Holy%20Stone/HCC_Series_DS.pdf; componentlink2description: DigiKey Link; componentlink2url: https://www.digikey.com/en/products/detail/holy-stone-enterprise-co-ltd/C0603B476M007T/16895203; Device Package: 0603 (1608 Metric); lastupdated: 2/9/2024 8:09:41 PM; Lifecycle Status: Active; Minimum Order: 1; Mounting Type: Surface Mount, MLCC; Operating Temperature: -55°C ~ 85°C; Package / Case: 0603 (1608 Metric); packaging: TapeAndReel; partid: 48531; Part Status: Active; price: 0.12; series: HCC; Size / Dimension: 0.063" L x 0.031" W (1.60mm x 0.80mm); Supplier 1: DigiKey; Supplier Part Number 1: 4587-C0603B476M007TCT-ND; Temperature Coefficient: X5R; Thickness (Max): 0.039" (1.00mm); Voltage - Rated: 6.3V
C31 = C0402C104K4RACAUTO: CAP CER 0.1UF 16V X7R 0402; manufacturer: KEMET; Tolerance: ±10%; Part Number: C0402C104K4RACAUTO; Value: 0.1 µF; Applications: Automotive, Bypass, Decoupling; Capacitance: 0.1 µF; componentlink1description: Datasheet; componentlink1url: https://api.kemet.com/component-edge/download/specsheet/C0402C104K4RACAUTO.pdf; componentlink2description: DigiKey Link; componentlink2url: https://www.digikey.com/en/products/detail/kemet/C0402C104K4RACAUTO/3314827; Device Package: 0402 (1005 Metric); lastupdated: 2/9/2024 8:04:35 PM; Lifecycle Status: Active; Minimum Order: 1; Mounting Type: Surface Mount, MLCC; Operating Temperature: -55°C ~ 125°C; Package / Case: 0402 (1005 Metric); packaging: TapeAndReel; partid: 3024; Part Status: Active; price: 0.01; Ratings: AEC-Q200; series: SMD Auto X7R; Size / Dimension: 0.039" L x 0.020" W (1.00mm x 0.50mm); Supplier 1: DigiKey; Supplier Part Number 1: 399-6828-1-ND; Temperature Coefficient: X7R; Thickness (Max): 0.022" (0.55mm); Voltage - Rated: 16V
D1 D12 = SE10FGHM3/H: DIODE GEN PURP 400V 1A DO219AB; Manufacturer: Vishay Semiconductor Diodes Division; Capacitance @ Vr, F: 7.5pF @ 4V, 1MHz; Current - Reverse Leakage @ Vr: 5µA @ 400V; Diode Type: Standard; Reverse Recovery Time (trr): 780ns; Speed: Standard Recovery >500ns, > 200mA (Io); Voltage - Forward (Vf) (Max) @ If: 1.05V @ 1A; Part Number: SE10FGHM3/H; ComponentLink1Description: Datasheet; ComponentLink1URL: http://www.vishay.com/docs/87722/se10fd-se10fg-se10fj.pdf; ComponentLink2Description: DigiKey Link; ComponentLink2URL: http://digikey.com/product-detail/en/vishay-semiconductor-diodes-division/SE10FGHM3-H/SE10FGHM3-HGICT-ND/8565217; Current - Average Rectified (Io): 1A; LastUpdated: 6/3/2024 8:05:29 PM; Lifecycle Status: Active; Minimum Order: 1; Mounting Type: Surface Mount; Operating Temperature - Junction: -55°C ~ 175°C; Package / Case: DO-219AB; Packaging: TapeAndReel; PartId: 1227; Part Status: Active; Price: 0.10; Series: Automotive, AEC-Q101; Supplier 1: DigiKey; Supplier Part Number 1: SE10FGHM3/HGICT-ND; Supplier Device Package: DO-219AB (SMF); Voltage - DC Reverse (Vr) (Max): 400V
L1 = AIML-1008HC-2R2M-T: FIXED IND 2.2UH 1.5A 90 MOHM SMD; Manufacturer: Abracon LLC; DC Resistance (DCR): 90mOhm; Frequency - Self Resonant: 40MHz; Inductance Frequency - Test: 1MHz; Material - Core: Ferrite; Shielding: Shielded; Tolerance: ±20%; Type: Multilayer; Part Number: AIML-1008HC-2R2M-T; ComponentLink1Description: Datasheet; ComponentLink1URL: https://abracon.com/Magnetics/inductors/AIML-1008HC.pdf; ComponentLink2Description: DigiKey Link; ComponentLink2URL: http://digikey.com/product-detail/en/abracon-llc/AIML-1008HC-2R2M-T/535-12795-1-ND/5043541; Current Rating (Amps): 1.5A; Device Package: 1008 (2520 Metric); Height - Seated (Max): 0.039" (1.00mm); Inductance: 2.2µH; LastUpdated: 9/2/2020 1:29:58 AM; Lifecycle Status: Active; Minimum Order: 1; Mounting Type: Surface Mount; Operating Temperature: -55°C ~ 125°C; Package / Case: 1008 (2520 Metric); Packaging: TapeAndReel; PartId: 3534; Part Status: Active; Price: 0.12; Series: AIML-1008HC; Size / Dimension: 0.098" L x 0.079" W (2.50mm x 2.00mm); Supplier 1: DigiKey; Supplier Part Number 1: 535-12795-1-ND; Supplier Device Package: 1008 (2520 Metric); Value: 2.2µH
L2 = MLP2520S4R7ST0S1: FIXED IND 4.7UH 1A 110 MOHM SMD; Manufacturer: TDK Corporation; DC Resistance (DCR): 143mOhm Max; Inductance Frequency - Test: 2MHz; Material - Core: Ferrite; Shielding: Shielded; Tolerance: ±20%; Type: Multilayer; Part Number: MLP2520S4R7ST0S1; ComponentLink1Description: Datasheet; ComponentLink1URL: https://product.tdk.com/info/en/catalog/datasheets/inductor_commercial_power_mlp2520_en.pdf?ref_disty=digikey; ComponentLink2Description: DigiKey Link; ComponentLink2URL: http://digikey.com/product-detail/en/tdk-corporation/MLP2520S4R7ST0S1/445-6378-1-ND/2465705; Current Rating (Amps): 1A; Device Package: 1008 (2520 Metric); Height - Seated (Max): 0.039" (1.00mm); Inductance: 4.7µH; LastUpdated: 9/2/2020 1:29:23 AM; Lifecycle Status: Active; Minimum Order: 1; Mounting Type: Surface Mount; Operating Temperature: -40°C ~ 125°C; Package / Case: 1008 (2520 Metric); Packaging: TapeAndReel; PartId: 3467; Part Status: Active; Price: 0.14; Series: MLP; Size / Dimension: 0.098" L x 0.079" W (2.50mm x 2.00mm); Supplier 1: DigiKey; Supplier Part Number 1: 445-6378-1-ND; Supplier Device Package: 1008 (2520 Metric); Value: 4.7µH
Q7 = NVTFS5C680NL: N-FET
R17-R20 R23 R24 R35 = RES_0402: RES 0402
R25 = APC0603B1K00N: 1/16 WATTS PRECISION CHIP 1 KILO; Manufacturer: Ohmite; Power (Watts): 0.063W, 1/16W; Resistance: 1 kOhms; Temperature Coefficient: ±25ppm/°C; Tolerance: ±0.1%; Part Number: APC0603B1K00N; Value: 1R; ComponentLink1Description: Datasheet; ComponentLink1URL: https://www.ohmite.com/assets/docs/APC-1-15.34.pdf; ComponentLink2Description: DigiKey Link; ComponentLink2URL: https://www.digikey.com/en/products/detail/ohmite/APC0603B1K00N/16369506; Composition: Thin Film; Device Package: 0603 (1608 Metric); Height - Seated (Max): 0.022" (0.55mm); LastUpdated: 2/9/2024 8:40:40 PM; Lifecycle Status: Active; Minimum Order: 1; Number of Terminations: 2; Operating Temperature: -55°C ~ 155°C; Package / Case: 0603 (1608 Metric); Packaging: TapeAndReel; PartId: 78336; Part Status: Active; Price: 0.05; Series: APC; Size / Dimension: 0.061" L x 0.031" W (1.55mm x 0.80mm); Supplier 1: DigiKey; Supplier Part Number 1: 273-APC0603B1K00NCT-ND; Supplier Device Package: 0603
R31 = KRL1632E-M-R039-F-T5: RES 0.039 OHM 1% 3/4W 1206; Manufacturer: Susumu; Power (Watts): 0.75W, 3/4W; Resistance: 39 mOhms; Temperature Coefficient: ±50ppm/°C; Value: 39 mOhms; Part Number: KRL1632E-M-R039-F-T5; ComponentLink1Description: Datasheet; ComponentLink1URL: http://www.susumu.co.jp/common/pdf/n_catalog_partition09_en.pdf; ComponentLink2Description: DigiKey Link; ComponentLink2URL: https://www.digikey.com/en/products/detail/susumu/KRL1632E-M-R039-F-T5/3738003; Composition: Metal Foil; Device Package: 1206 (3216 Metric); Features: Automotive AEC-Q200, Current Sense; Height - Seated (Max): 0.028" (0.70mm); LastUpdated: 2/9/2024 8:54:46 PM; Lifecycle Status: Active; Minimum Order: 1; Number of Terminations: 2; Operating Temperature: -55°C ~ 155°C; Package / Case: 1206 (3216 Metric); Packaging: TapeAndReel; PartId: 26838; Part Status: Active; Price: 0.09; Ratings: AEC-Q200; Series: KRL; Size / Dimension: 0.126" L x 0.063" W (3.20mm x 1.60mm); Supplier 1: DigiKey; Supplier Part Number 1: 408-1577-1-ND; Supplier Device Package: 1206; Tolerance: ±1%
U9 = LM25085: PFET Buck Controller
U10 = AP63205WU-7: 5V fixed step down Buck
U11 U12 = TLV74033PDQNR
U14 = INA185: INA185A2

## Sheet Half_Bridges.SchDoc
size B; DocumentNumber: 6; SheetNumber: 4; SheetTotal: 4
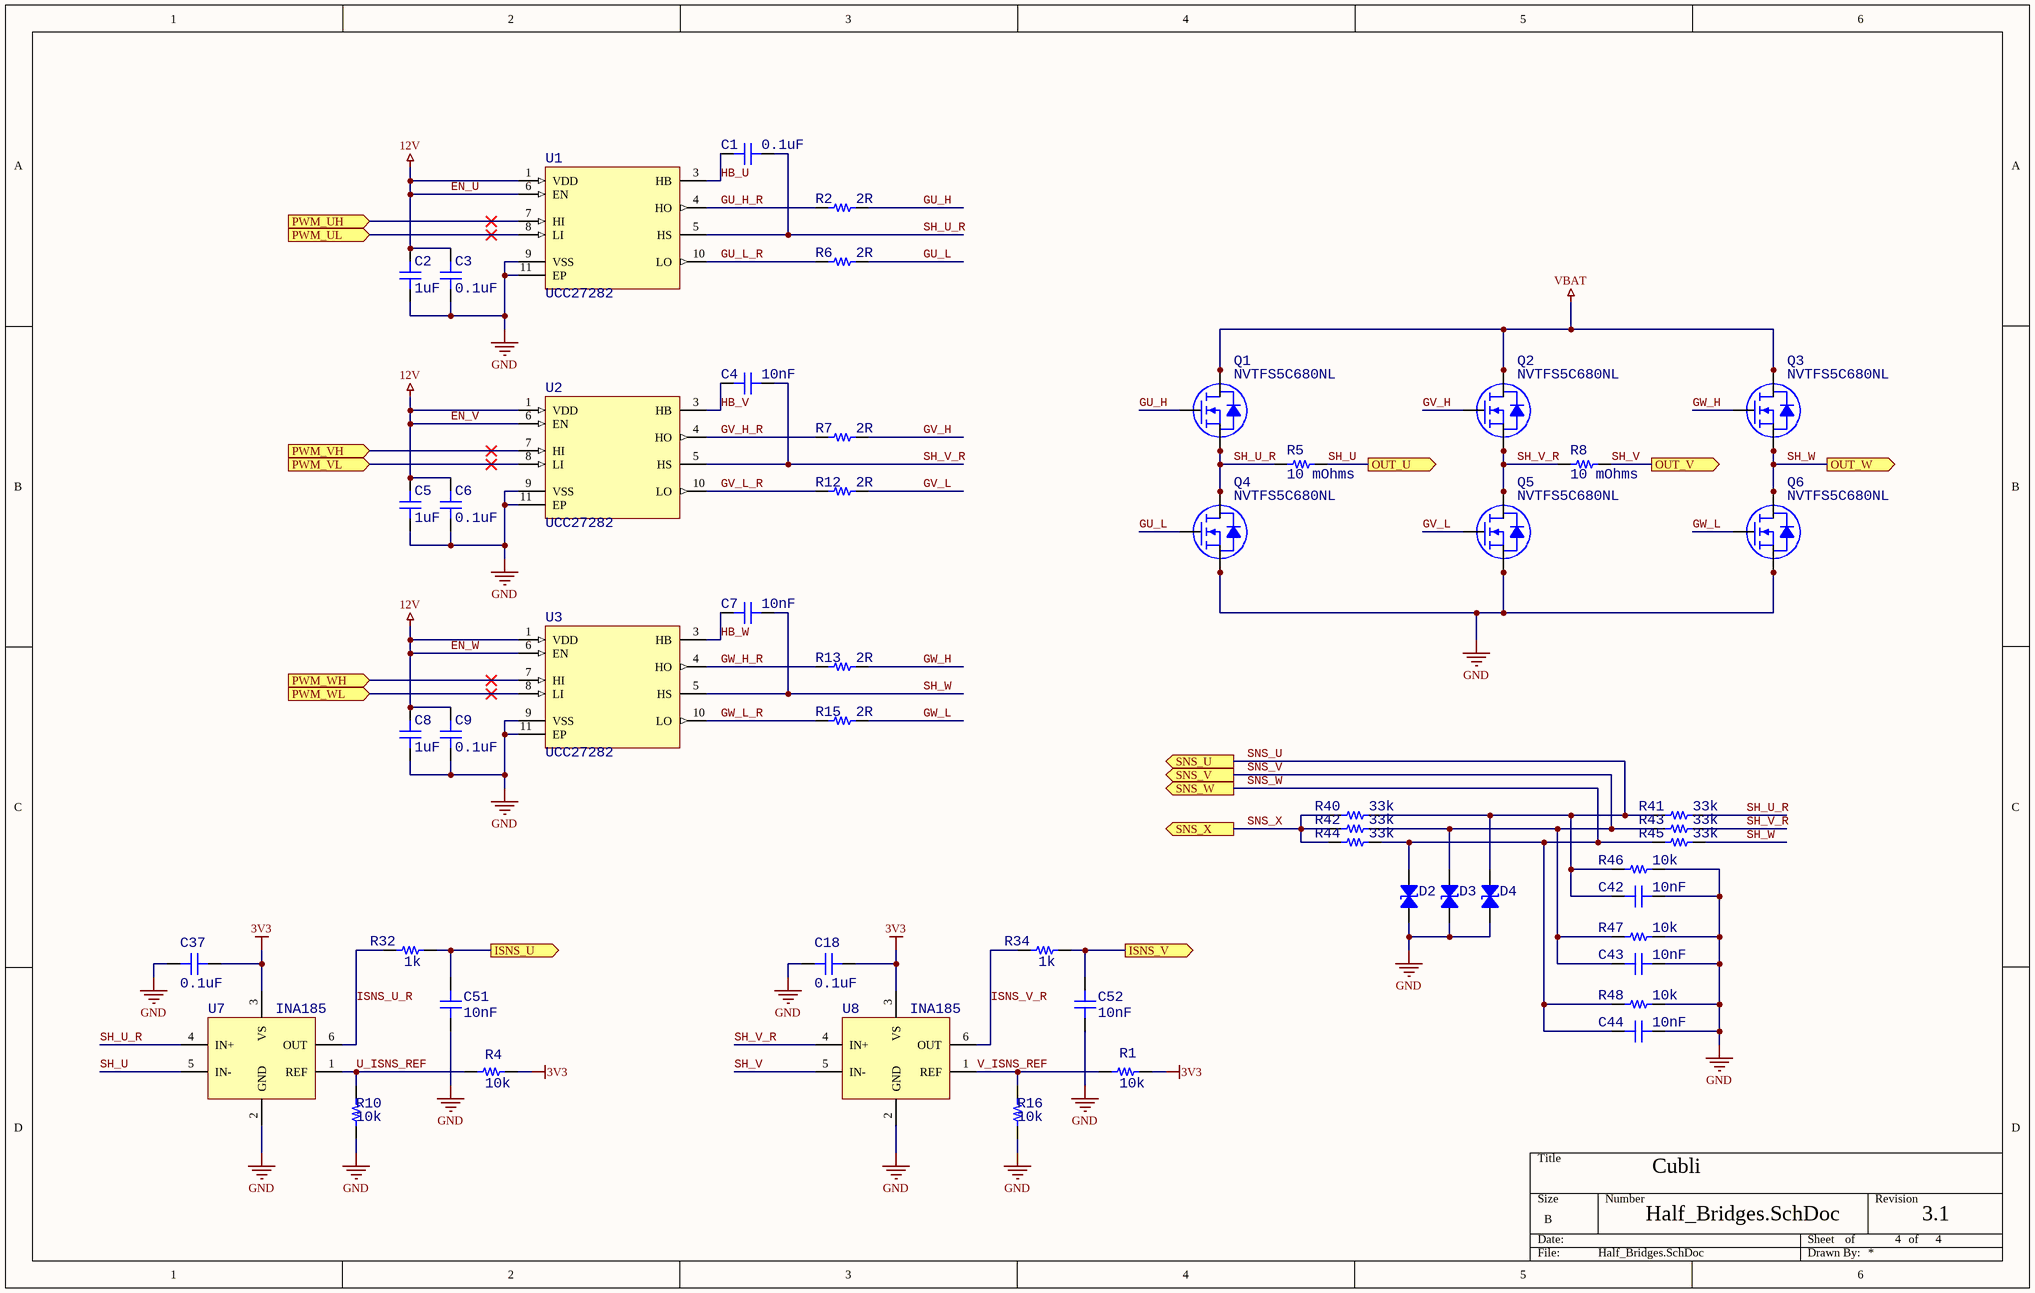
[diagram p3: Half_Bridges.SchDoc]

### Parts
C1  0.1uF  [CAP_0402]
C2  1uF  [CAP_0402]
C3  0.1uF  [CAP_0402]
C4  10nF  [CAP_0402]
C5  1uF  [CAP_0402]
C6  0.1uF  [CAP_0402]
C7  10nF  [CAP_0402]
C8  1uF  [CAP_0402]
C9  0.1uF  [CAP_0402]
C18  0.1uF  [CAP_0402]
C37  0.1uF  [CAP_0402]
C42  10nF  [CAP_0402]
C43  10nF  [CAP_0402]
C44  10nF  [CAP_0402]
C51  10nF  [CAP_0402]
C52  10nF  [CAP_0402]
D2  TVN3V3B1S-DFN1006-2LDG  [0402]  (value not drawn)
D3  TVN3V3B1S-DFN1006-2LDG  [0402]  (value not drawn)
D4  TVN3V3B1S-DFN1006-2LDG  [0402]  (value not drawn)
Q1  NVTFS5C680NL  [NVTFS015N04CTAG]
Q2  NVTFS5C680NL  [NVTFS015N04CTAG]
Q3  NVTFS5C680NL  [NVTFS015N04CTAG]
Q4  NVTFS5C680NL  [NVTFS015N04CTAG]
Q5  NVTFS5C680NL  [NVTFS015N04CTAG]
Q6  NVTFS5C680NL  [NVTFS015N04CTAG]
R1  10k  [RES_0402]
R2  2R  [RES_0402]
R4  10k  [RES_0402]
R5  10 mOhms  [RES 1206_3216]
R6  2R  [RES_0402]
R7  2R  [RES_0402]
R8  10 mOhms  [RES 1206_3216]
R10  10k  [RES_0402]
R12  2R  [RES_0402]
R13  2R  [RES_0402]
R15  2R  [RES_0402]
R16  10k  [RES_0402]
R32  1k  [RES_0402]
R34  1k  [RES_0402]
R40  33k  [RES_0402]
R41  33k  [RES_0402]
R42  33k  [RES_0402]
R43  33k  [RES_0402]
R44  33k  [RES_0402]
R45  33k  [RES_0402]
R46  10k  [RES_0402]
R47  10k  [RES_0402]
R48  10k  [RES_0402]
U1  UCC27282  [VSON-10]
U2  UCC27282  [VSON-10]
U3  UCC27282  [VSON-10]
U7  INA185  [TI SC70-6 DCK]
U8  INA185  [TI SC70-6 DCK]

### Ports
ISNS_U (out), ISNS_V (out), OUT_U (out), OUT_V (out), OUT_W (out), PWM_UH (in), PWM_UL (in), PWM_VH (in), PWM_VL (in), PWM_WH (in), PWM_WL (in), SNS_U (out), SNS_V (out), SNS_W (out), SNS_X (out)

### Nets
3V3: C18.1 C37.1 R1.1 R4.1 U7.3(VS) U8.3(VS)
12V: C2.1 C3.1 C5.1 C6.1 C8.1 C9.1 U1.1(VDD) U1.6(EN) U2.1(VDD) U2.6(EN) U3.1(VDD) U3.6(EN)  [also labelled EN_U, EN_V, EN_W]
GND: C2.2 C3.2 C5.2 C6.2 C8.2 C9.2 C18.2 C37.2 C42.1 C43.1 C44.1 C51.2 C52.2 D2.1 D3.1 D4.1 Q4.1(S) Q4.2(S) Q4.3(S) Q5.1(S) Q5.2(S) Q5.3(S) Q6.1(S) Q6.2(S) Q6.3(S) R10.2 R16.2 R46.2 R47.2 R48.2 U1.9(VSS) U1.11(EP) U2.9(VSS) U2.11(EP) U3.9(VSS) U3.11(EP) U7.2(GND) U8.2(GND)
VBAT: Q1.5(D) Q1.6(D) Q1.7(D) Q1.8(D) Q2.5(D) Q2.6(D) Q2.7(D) Q2.8(D) Q3.5(D) Q3.6(D) Q3.7(D) Q3.8(D)
GU_H: Q1.4(G) R2.2
GU_H_R: R2.1 U1.4(HO)
GU_L: Q4.4(G) R6.2
GU_L_R: R6.1 U1.10(LO)
GV_H: Q2.4(G) R7.2
GV_H_R: R7.1 U2.4(HO)
GV_L: Q5.4(G) R12.2
GV_L_R: R12.1 U2.10(LO)
GW_H: Q3.4(G) R13.2
GW_H_R: R13.1 U3.4(HO)
GW_L: Q6.4(G) R15.2
GW_L_R: R15.1 U3.10(LO)
HB_U: C1.2 U1.3(HB)
HB_V: C4.2 U2.3(HB)
HB_W: C7.2 U3.3(HB)
ISNS_U: C51.1 R32.1 ; port ISNS_U
ISNS_U_R: R32.2 U7.6(OUT)
ISNS_V: C52.1 R34.1 ; port ISNS_V
ISNS_V_R: R34.2 U8.6(OUT)
PWM_UH: U1.7(HI) ; port PWM_UH
PWM_UL: U1.8(LI) ; port PWM_UL
PWM_VH: U2.7(HI) ; port PWM_VH
PWM_VL: U2.8(LI) ; port PWM_VL
PWM_WH: U3.7(HI) ; port PWM_WH
PWM_WL: U3.8(LI) ; port PWM_WL
SH_U: R5.2 U7.5(IN-) ; port OUT_U  [project net OUT_U]
SH_U_R: C1.1 Q1.1(S) Q1.2(S) Q1.3(S) Q4.5(D) Q4.6(D) Q4.7(D) Q4.8(D) R5.1 R41.1 U1.5(HS) U7.4(IN+)
SH_V: R8.2 U8.5(IN-) ; port OUT_V  [project net OUT_V]
SH_V_R: C4.1 Q2.1(S) Q2.2(S) Q2.3(S) Q5.5(D) Q5.6(D) Q5.7(D) Q5.8(D) R8.1 R43.1 U2.5(HS) U8.4(IN+)
SH_W: C7.1 Q3.1(S) Q3.2(S) Q3.3(S) Q6.5(D) Q6.6(D) Q6.7(D) Q6.8(D) R45.1 U3.5(HS) ; port OUT_W  [project net OUT_W]
SNS_U: C42.2 D4.2 R40.1 R41.2 R46.1 ; port SNS_U  [project net VSNS_U]
SNS_V: C43.2 D3.2 R42.1 R43.2 R47.1 ; port SNS_V  [project net VSNS_V]
SNS_W: C44.2 D2.2 R44.1 R45.2 R48.1 ; port SNS_W  [project net VSNS_W]
SNS_X: R40.2 R42.2 R44.2 ; port SNS_X  [project net VSNS_X]
U_ISNS_REF: R4.2 R10.1 U7.1(REF)
V_ISNS_REF: R1.2 R16.1 U8.1(REF)

### Notes on the sheet
- of

### Library data of the parts
C1-C9 C18 C37 C42-C44 C51 C52 = CAP_0402: CAP CER 402
  C1 C3 C6 C9 C18 C37: Value: 0.1uF
  C2 C5 C8: Value: 1uF
  C4 C7 C42-C44 C51 C52: Value: 10nF
D2-D4 = TVN3V3B1S-DFN1006-2LDG: as D5 on sheet Top; Part Number: TVN3V3B1S-DFN1006-2LDG; Applications: General Purpose; ComponentLink1Description: Datasheet; ComponentLink1URL: https://mm.digikey.com/Volume0/opasdata/d220001/medias/docus/5383/TVN3V3B1S-DFN1006-2LDG.pdf; ComponentLink2Description: DigiKey Link; ComponentLink2URL: https://www.digikey.com/en/products/detail/inpaq-technology-co-ltd/TVN3V3B1S-DFN1006-2LDG/20486686; Device Package: 0402 (1005 Metric); LastUpdated: 6/3/2024 8:22:57 PM; Lifecycle Status: Active; Minimum Order: 1; Mounting Type: Surface Mount; Operating Temperature: 150°C (TJ); Package / Case: 0402 (1005 Metric); Packaging: TapeAndReel; PartId: 11821; Price: 0.02; Series: TVN; Supplier 1: DigiKey; Supplier Part Number 1: 3526-TVN3V3B1S-DFN1006-2LDGCT-ND; Supplier Device Package: DFN1006
Q1-Q6 = NVTFS5C680NL: N-FET
R1 R2 R4 R6 R7 R10 R12 R13 R15 R16 R32 R34 R40-R48 = RES_0402: RES 0402
R5 R8 = KRL1632E-M-R039-F-T5: as R31 on sheet Power; Part Number: KRL1632E-M-R039-F-T5; ComponentLink1Description: Datasheet; ComponentLink1URL: http://www.susumu.co.jp/common/pdf/n_catalog_partition09_en.pdf; ComponentLink2Description: DigiKey Link; ComponentLink2URL: https://www.digikey.com/en/products/detail/susumu/KRL1632E-M-R039-F-T5/3738003; Composition: Metal Foil; Device Package: 1206 (3216 Metric); Features: Automotive AEC-Q200, Current Sense; Height - Seated (Max): 0.028" (0.70mm); LastUpdated: 2/9/2024 8:54:46 PM; Lifecycle Status: Active; Minimum Order: 1; Number of Terminations: 2; Operating Temperature: -55°C ~ 155°C; Package / Case: 1206 (3216 Metric); Packaging: TapeAndReel; PartId: 26838; Part Status: Active; Price: 0.09; Ratings: AEC-Q200; Series: KRL; Size / Dimension: 0.126" L x 0.063" W (3.20mm x 1.60mm); Supplier 1: DigiKey; Supplier Part Number 1: 408-1577-1-ND; Supplier Device Package: 1206; Tolerance: ±1%
U1-U3 = UCC27282DRCR: 3-A, 120-V half bridge gate driver with 5-V UVLO, interlock and enable 10-VSON -40 to 125; MF: Texas Instruments; Texas_Instruments-Purchase-URL: https://snapeda.com/shop?store=Texas+Instruments&id=3625400; Price: None; Availability: Warning; Package: VSON-10 Texas Instruments; SnapEDA_Link: https://www.snapeda.com/parts/UCC27282DRCR/Texas%20Instruments/view-part/3625400/?ref=snap; DigiKey-Purchase-URL: https://snapeda.com/shop?store=DigiKey&id=3625400; MP: UCC27282DRCR; Value: *
U7 U8 = INA185: INA185A2

## Nets that join several sheets
3V3: Top (C17.2 R21.2 U4.8), Power (C35.2 U12.1), Half_Bridges (6 pins)
3V3_MCU: Top (6 pins), STM32 (15 pins), Power (5 pins)
5V: Top (C73.1 J2.1 R22.2 U16.3), Power (11 pins)
12V: Top (R28.2), Power (14 pins), Half_Bridges (12 pins)
GND: Top (28 pins), STM32 (20 pins), Power (47 pins), Half_Bridges (38 pins)
VBAT: Top (R27.2), Power (27 pins), Half_Bridges (12 pins)
CAN_RX: Top (U16.4), STM32 (U6.47)
CAN_S: Top (U16.8), STM32 (U6.2)
CAN_TX: Top (U16.1), STM32 (U6.48)
COMP_OUT_U: Top (U13.14), STM32 (U6.63)
COMP_OUT_V: Top (U13.15), STM32 (U6.64)
COMP_OUT_W: Top (U13.16), STM32 (U6.65)
ENC_PWR_EN: Top (U15.5), STM32 (U6.3)
ISNS_U: STM32 (U6.16), Half_Bridges (C51.1 R32.1)
ISNS_V: STM32 (U6.15), Half_Bridges (C52.1 R34.1)
ISNS_VIN: STM32 (U6.8), Power (C53.1 R35.1)
OUT_U: Top (J_MTR.1), Half_Bridges (R5.2 U7.5)
OUT_V: Top (J_MTR.2), Half_Bridges (R8.2 U8.5)
OUT_W: Top (J_MTR.3), Half_Bridges (10 pins)
PWM_UH: STM32 (U6.44), Half_Bridges (U1.7)
PWM_UL: STM32 (U6.35), Half_Bridges (U1.8)
PWM_VH: STM32 (U6.45), Half_Bridges (U2.7)
PWM_VL: STM32 (U6.26), Half_Bridges (U2.8)
PWM_WH: STM32 (U6.46), Half_Bridges (U3.7)
PWM_WL: STM32 (U6.27), Half_Bridges (U3.8)
RX: Top (R14.1), STM32 (J3.7 U6.37)
SCL: Top (U4.2 U5.2), STM32 (U6.60)
SDA: Top (U4.1 U5.1), STM32 (U6.61)
SERVO: Top (J2.3), STM32 (U6.56)
TX: Top (R9.1), STM32 (J3.6 U6.36)
VSNS_12V: Top (C49.2 D6.2 R28.1 R30.1), STM32 (U6.10)
VSNS_U: Top (U13.8), STM32 (U6.17), Half_Bridges (5 pins)
VSNS_V: Top (U13.6), STM32 (U6.24), Half_Bridges (5 pins)
VSNS_VBAT: Top (C45.2 D5.2 R27.1 R29.1), STM32 (U6.9)
VSNS_W: Top (U13.4), STM32 (U6.25), Half_Bridges (5 pins)
VSNS_X: Top (U13.2 U13.5 U13.7), STM32 (U6.11), Half_Bridges (R40.2 R42.2 R44.2)

## Assembly variants
Main: not fitted R1 R21 R22